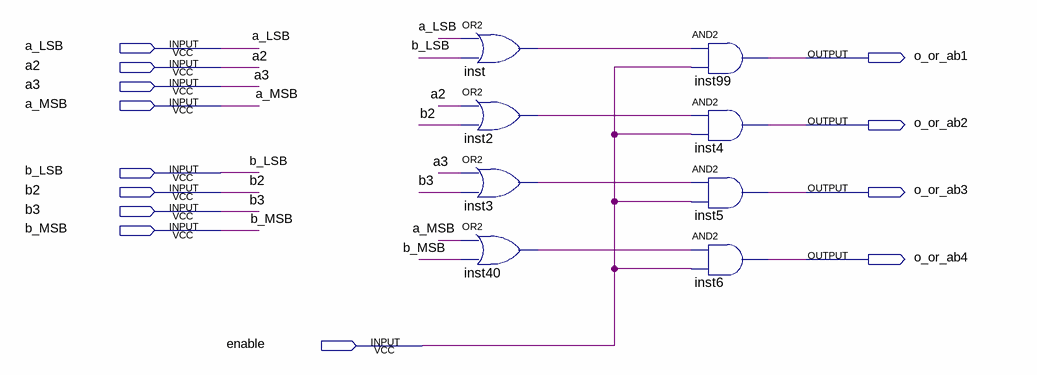
[diagram p0: schematic sheet]
// Quartus schematic full_or.bdf as structural Verilog: 8 symbols, 13 pins
module full_or (
  input  a_LSB,
  input  a2,
  input  a3,
  input  a_MSB,
  input  b_LSB,
  input  b2,
  input  b3,
  input  b_MSB,
  input  enable,
  output o_or_ab1,
  output o_or_ab2,
  output o_or_ab3,
  output o_or_ab4
);

  wire inst2_out, inst3_out, inst40_out, inst_out;

  or inst (inst_out, a_LSB, b_LSB);
  or inst2 (inst2_out, a2, b2);
  or inst3 (inst3_out, a3, b3);
  or inst40 (inst40_out, a_MSB, b_MSB);
  and inst99 (o_or_ab1, inst_out, enable);
  and inst4 (o_or_ab2, inst2_out, enable);
  and inst5 (o_or_ab3, inst3_out, enable);
  and inst6 (o_or_ab4, inst40_out, enable);
endmodule
